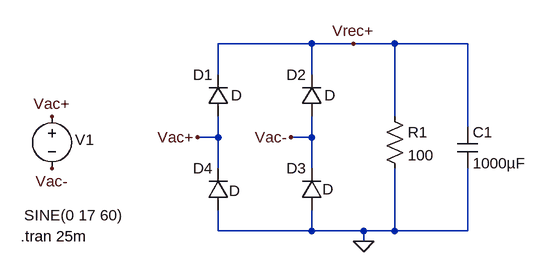
[diagram p0: schematic acRectifier.asc]
acRectifier.asc, the LTspice schematic file:
Version 4.1
SHEET 1 880 680
WIRE 448 -16 304 -16
WIRE 512 -16 448 -16
WIRE 576 -16 512 -16
WIRE 688 -16 576 -16
WIRE 304 32 304 -16
WIRE 448 32 448 -16
WIRE 576 96 576 -16
WIRE 688 112 688 -16
WIRE 304 128 304 96
WIRE 304 128 272 128
WIRE 448 128 448 96
WIRE 448 128 416 128
WIRE 304 176 304 128
WIRE 448 176 448 128
WIRE 304 272 304 240
WIRE 448 272 448 240
WIRE 448 272 304 272
WIRE 528 272 448 272
WIRE 576 272 576 176
WIRE 576 272 528 272
WIRE 688 272 688 176
WIRE 688 272 576 272
WIRE 528 288 528 272
FLAG 48 96 Vac+
FLAG 48 176 Vac-
FLAG 528 288 0
FLAG 272 128 Vac+
FLAG 416 128 Vac-
FLAG 512 -16 Vrec+
SYMBOL voltage 48 80 R0
WINDOW 123 0 0 Left 0
WINDOW 39 0 0 Left 0
WINDOW 0 36 52 Left 2
WINDOW 3 -43 168 Left 2
SYMATTR InstName V1
SYMATTR Value SINE(0 17 60)
SYMBOL diode 320 96 R180
WINDOW 0 24 64 Left 2
WINDOW 3 -21 33 Left 2
SYMATTR InstName D1
SYMBOL diode 464 96 R180
WINDOW 0 24 64 Left 2
WINDOW 3 -21 33 Left 2
SYMATTR InstName D2
SYMBOL diode 464 240 R180
WINDOW 0 24 64 Left 2
WINDOW 3 -18 32 Left 2
SYMATTR InstName D3
SYMBOL diode 320 240 R180
WINDOW 0 24 64 Left 2
WINDOW 3 -18 30 Left 2
SYMATTR InstName D4
SYMBOL res 560 80 R0
SYMATTR InstName R1
SYMATTR Value 100
SYMBOL cap 672 112 R0
SYMATTR InstName C1
SYMATTR Value 1000µF
TEXT 0 280 Left 2 !.tran 25m

The netlist it stands for:
* acRectifier.asc
V1 Vac+ Vac- SINE(0 17 60)
D1 Vac+ Vrec+ D
D2 Vac- Vrec+ D
D3 0 Vac- D
D4 0 Vac+ D
R1 Vrec+ 0 100
C1 Vrec+ 0 1000µF
.model D D
.lib standard.dio
.tran 25m
.backanno
.end